# EAGLE schematic montaj_electric_nou (EAGLE 9.6.2)
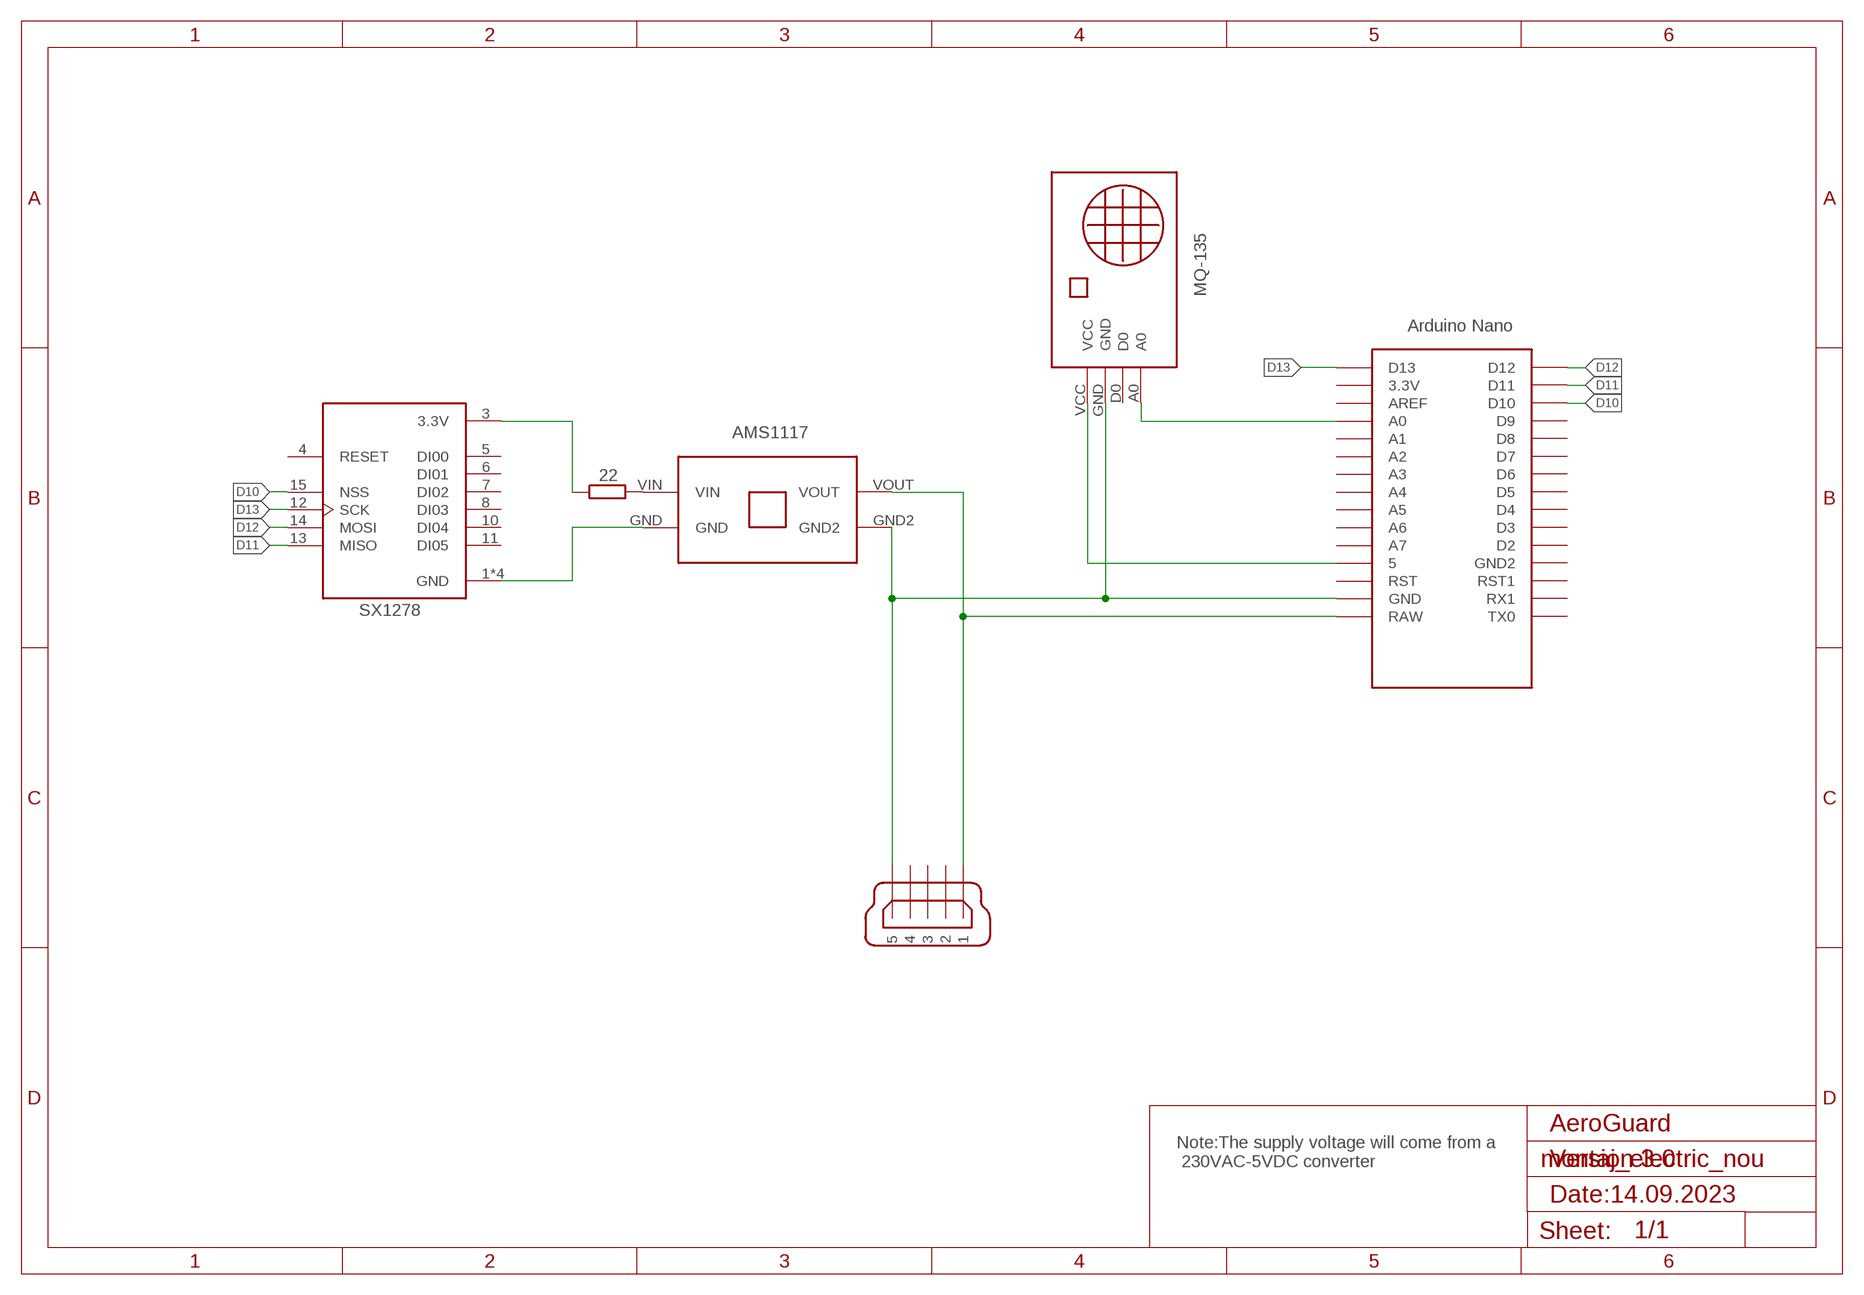
[diagram p0: schematic, sheet 1]

## Parts
22  R-EU_0207/12  [0207/12]
U1  RA-02_LORA  [MODULE_RA-02_LORA]
U$1  NANO  [NANO]
U$2  DEV  [FOOT]
U$3  AMS1117  [AMS1117]
X1  MINI-USB-SHIELD-UX60-MB-5S8  [UX60-MB-5S8]

## Nets
D10: U1.15(NSS) U$1.D10
D11: U1.13(MISO) U$1.D11
D12: U1.14(MOSI) U$1.D12
D13: U1.12(SCK) U$1.D13
N$1: U$1.RAW U$3.VOUT X1.1
N$2: U$1.GND U$2.GND U$3.GND2 X1.5
N$3: U$1.A0 U$2.A0
N$4: U$1.5V U$2.VCC
N$5: 22.2 U$3.VIN
N$6: 22.1 U1.3(3.3V)
N$7: U1.1(GND) U1.2(GND) U1.9(GND) U1.16(GND) U$3.GND
Unconnected: U1.4(RESET) U1.5(DI00) U1.6(DI01) U1.7(DI02) U1.8(DI03) U1.10(DI04) U1.11(DI05) U$1.3.3V U$1.A1 U$1.A2 U$1.A3 U$1.A4 U$1.A5 U$1.A6 U$1.A7 U$1.AREF U$1.D2 U$1.D3 U$1.D4 U$1.D5 U$1.D6 U$1.D7 U$1.D8 U$1.D9 U$1.GND1(GND2) U$1.ICSP1 U$1.ICSP2 U$1.ICSP3 U$1.ICSP4 U$1.ICSP5 U$1.ICSP6 U$1.RST U$1.RST1 U$1.RX1 U$1.TX0 U$2.D0 X1.2 X1.3 X1.4 X1.M1(S1) X1.M2(S2) X1.M3(S3) X1.M4(S4)

## Notes on the sheet
- SX1278
- AeroGuard
- Note:The supply voltage will come from a
   230VAC-5VDC converter
- Version 3.0
- Date:14.09.2023

## Library data of the parts
22 = rcl:R-EU_: RESISTOR, European symbol; SPICEPREFIX: R
U1 = RA-02_LORA:RA-02_LORA: Ra-02 LoRa RF M5Stack Platform Evaluation Expansion Board Check availability <https://pricing.snapeda.com/parts/Ra-02%20LoRa/AI-Thinker/view-part?ref=eda>; AVAILABILITY: Not in stock; CHECK_PRICES: https://www.snapeda.com/parts/Ra-02%20LoRa/AI-Thinker/view-part/?ref=eda; DESCRIPTION: Ra-02 LoRa RF M5Stack Platform Evaluation Expansion Board; MF: AI-Thinker; MP: Ra-02 LoRa; PACKAGE: None; PRICE: None; SNAPEDA_LINK: https://www.snapeda.com/parts/Ra-02%20LoRa/AI-Thinker/view-part/?ref=snap
U$1 = Arduino-clone:NANO: Arduino Nano
U$2 = MQ-135(test):DEV
U$3 = ams1117-modul:AMS1117
X1 = con-hirose:MINI-USB-SHIELD-: MINI USB Connector Source: http://www.hirose.co.jp/cataloge_hp/e24000019.pdf; OC_FARNELL: unknown; OC_NEWARK: unknown